# Altium schematic sheet 1-AT_Link_EZ_V1.2.schdoc
size 307 x 228 mm
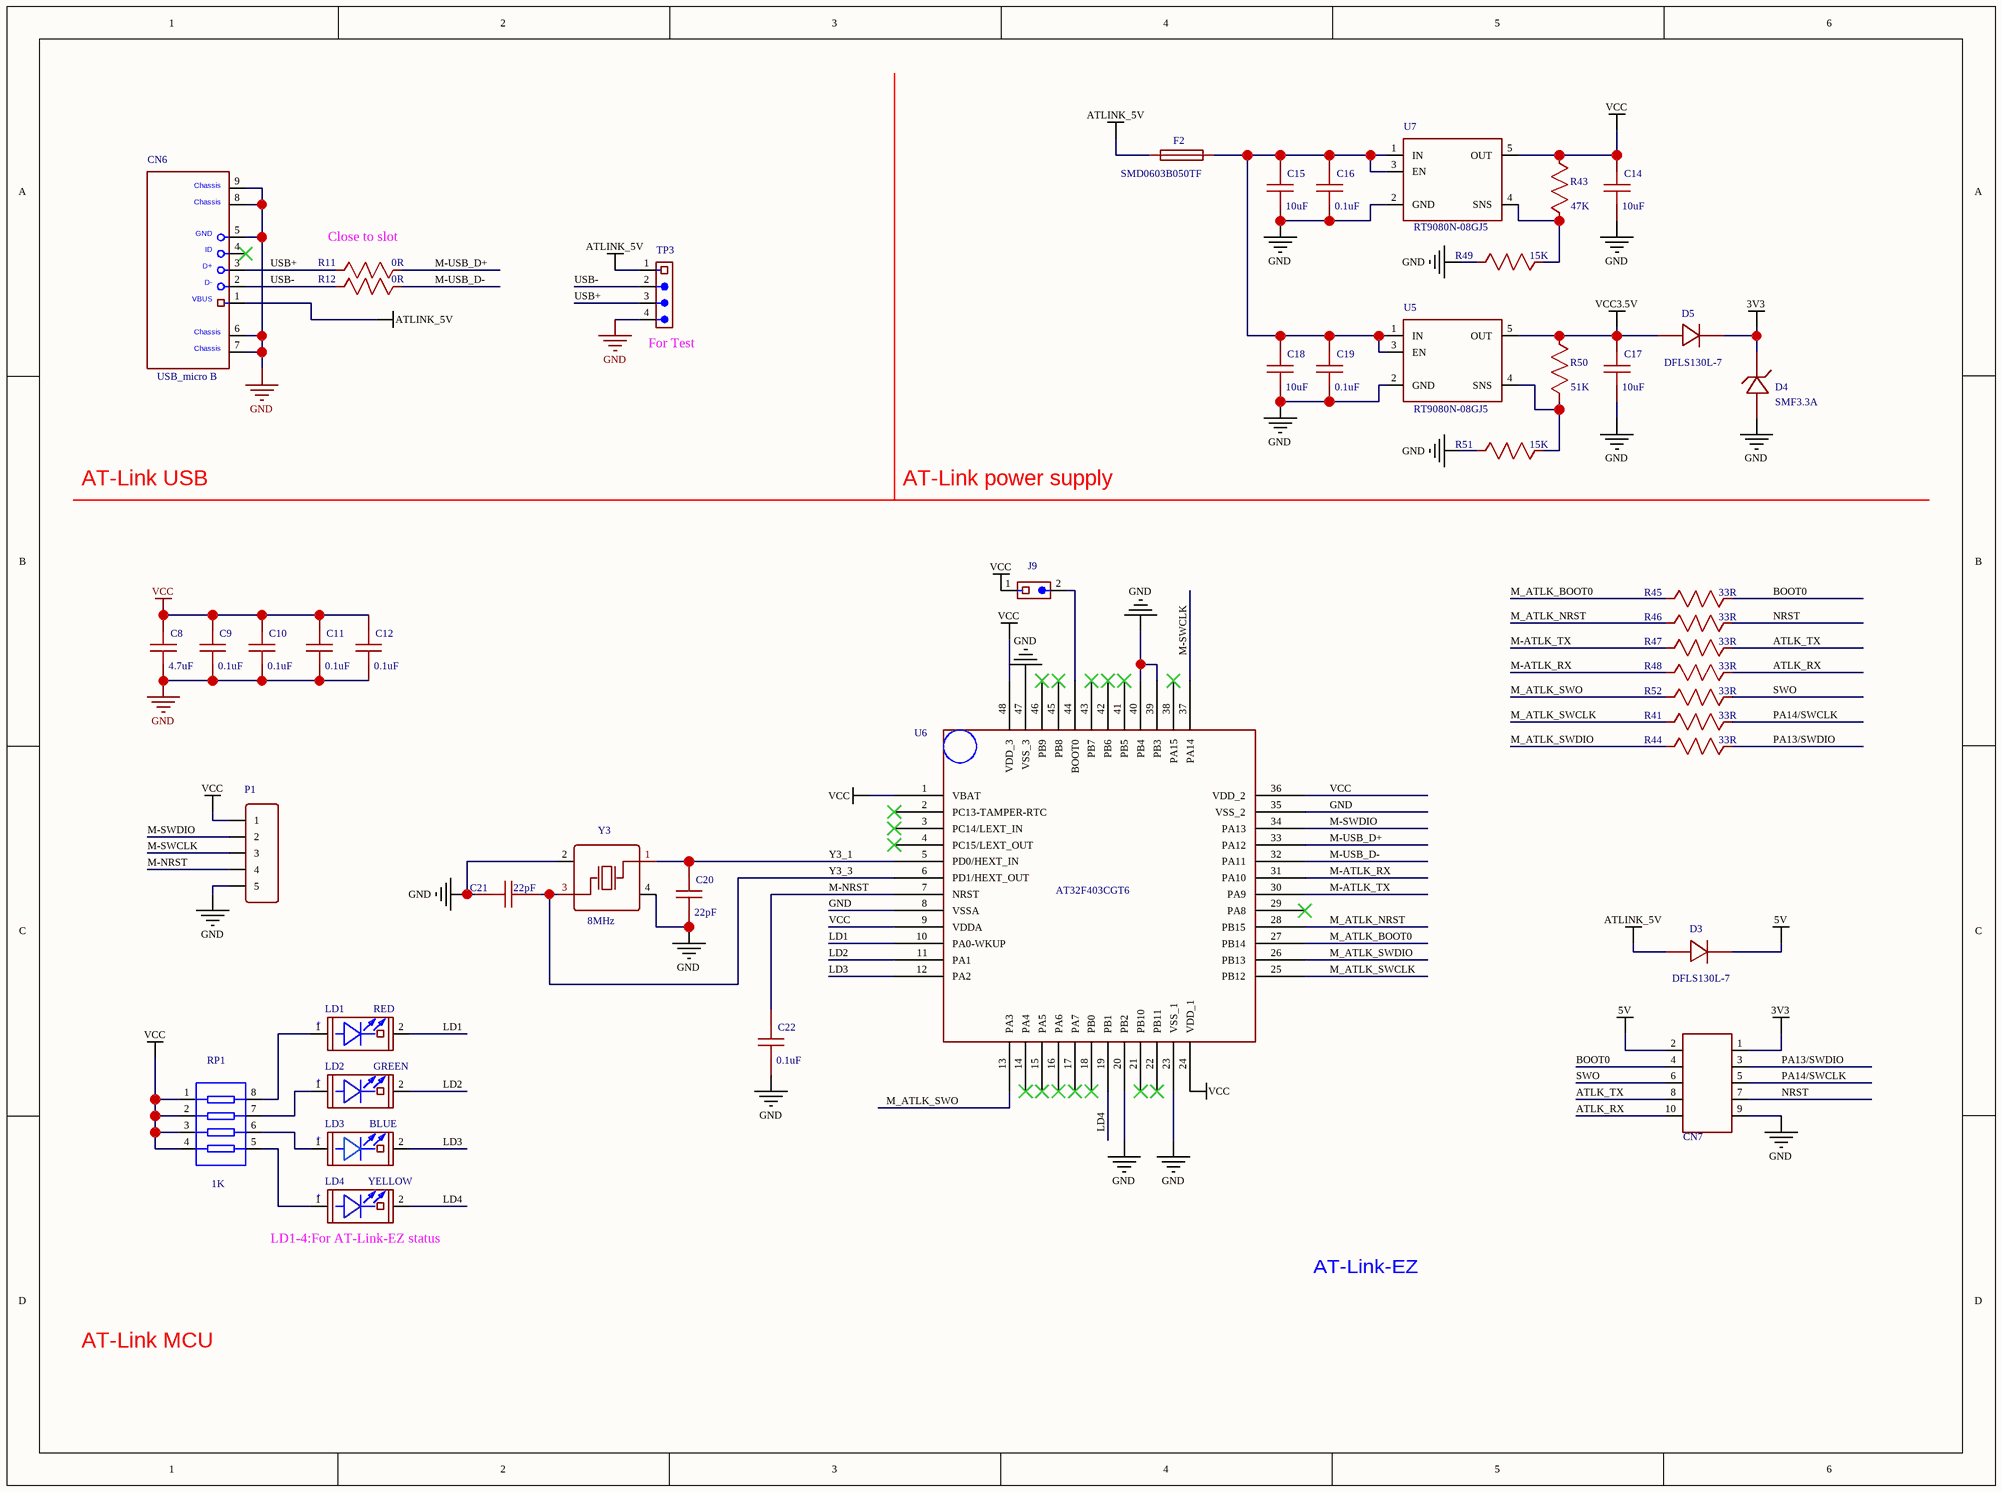
[diagram p0: 1-AT_Link_EZ_V1.2.schdoc]

## Parts
C8  4.7uF  [0603_C-M]
C9  0.1uF  [0603_C-M]
C10  0.1uF  [0603_C-M]
C11  0.1uF  [0603_C-M]
C12  0.1uF  [0603_C-M]
C14  10uF  [0603_C-M]
C15  10uF  [0603_C-M]
C16  0.1uF  [0603_C-M]
C17  10uF  [0603_C-M]
C18  10uF  [0603_C-M]
C19  0.1uF  [0603_C-M]
C20  22pF  [0603_C-M]
C21  22pF  [0603_C-M]
C22  0.1uF  [0603_C-M]
CN6  USB_micro B  [USB_MIC_DIP]
CN7  CON1  [HDR2X5]  (value not drawn)
D3  DFLS130L-7  [POWERDI-123_L2.8-W1.8-LS3.7-RD]
D4  SMF3.3A  [SOD-123_L2.8-W1.8-LS3.7-RD]
D5  DFLS130L-7  [POWERDI-123_L2.8-W1.8-LS3.7-RD]
F2  SMD0603B050TF  [R0603]
J9  1X2P,Male,DIP_2.54  [HDR1X2]  (value not drawn)
LD1  RED  [LED0603]
LD2  GREEN  [LED0603]
LD3  BLUE  [LED0603]
LD4  YELLOW  [LED0603]
P1  HDR-M-2.54_1x5  [HDR-M-2.54_1X5]  (value not drawn)
R11  0R  [0603_R-M]
R12  0R  [0603_R-M]
R41  33R  [0603_R-M]
R43  47K  [0603_R-M]
R44  33R  [0603_R-M]
R45  33R  [0603_R-M]
R46  33R  [0603_R-M]
R47  33R  [0603_R-M]
R48  33R  [0603_R-M]
R49  15K  [0603_R-M]
R50  51K  [0603_R-M]
R51  15K  [0603_R-M]
R52  33R  [0603_R-M]
RP1  1K  [0603*4,8P4R]
TP3  1X4P_2.54F  [HDR1X4 - TOP]  (value not drawn)
U5  RT9080N-08GJ5  [SOT-23-5]
U6  AT32F403CGT6  [LQFP48 - 2]
U7  RT9080N-08GJ5  [SOT-23-5]
Y3  8MHz  [OSC-SMD_4P-L5.0-W3.2-BL]

## Nets
3V3: CN7.1 D4.1 D5.1
5V: CN7.2 D3.1
ATLINK_5V: CN6.1(VBUS) D3.2 F2.1 TP3.1
GND: C8.2 C9.2 C10.2 C11.2 C12.2 C14.2 C15.2 C16.2 C17.2 C18.2 C19.2 C20.2 C21.1 C22.2 CN6.5(GND) CN6.6 CN6.7 CN6.8 CN6.9 CN7.9 D4.2 P1.5 R49.2 R51.2 TP3.4 U5.2(GND) U6.8(VSSA) U6.20(PB2) U6.23(VSS_1) U6.35(VSS_2) U6.39(PB3) U6.40(PB4) U6.47(VSS_3) U7.2(GND) Y3.2(GND) Y3.4(GND)
VCC: C8.1 C9.1 C10.1 C11.1 C12.1 C14.1 J9.1 P1.1 R43.2 RP1.1 RP1.2 RP1.3 RP1.4 U6.1(VBAT) U6.9(VDDA) U6.24(VDD_1) U6.36(VDD_2) U6.48(VDD_3) U7.5(OUT)
VCC3.5V: C17.1 D5.2 R50.2 U5.5(OUT)
ATLK_RX: CN7.10 R48.1
ATLK_TX: CN7.8 R47.1
BOOT0: CN7.4 R45.1
LD1: LD1.2(CATHODE) U6.10(PA0-WKUP)
LD2: LD2.2(CATHODE) U6.11(PA1)
LD3: LD3.2(CATHODE) U6.12(PA2)
LD4: LD4.2(CATHODE) U6.19(PB1)
M-ATLK_RX: R48.2 U6.31(PA10)
M-ATLK_TX: R47.2 U6.30(PA9)
M-NRST: C22.1 P1.4 U6.7(NRST)
M-SWCLK: P1.3 U6.37(PA14)
M-SWDIO: P1.2 U6.34(PA13)
M-USB_D+: R11.2 U6.33(PA12)
M-USB_D-: R12.2 U6.32(PA11)
M_ATLK_BOOT0: R45.2 U6.27(PB14)
M_ATLK_NRST: R46.2 U6.28(PB15)
M_ATLK_SWCLK: R41.2 U6.25(PB12)
M_ATLK_SWDIO: R44.2 U6.26(PB13)
M_ATLK_SWO: R52.2 U6.13(PA3)
NRST: CN7.7 R46.1
PA13/SWDIO: CN7.3 R44.1
PA14/SWCLK: CN7.5 R41.1
SWO: CN7.6 R52.1
USB+: CN6.3(D+) R11.1 TP3.3
USB-: CN6.2(D-) R12.1 TP3.2
Y3_1: C20.1 U6.5(PD0/HEXT_IN) Y3.1(OSC1)
Y3_3: C21.2 U6.6(PD1/HEXT_OUT) Y3.3(OSC2)
NetC15_1: C15.1 C16.1 C18.1 C19.1 F2.2 U5.1(IN) U5.3(EN) U7.1(IN) U7.3(EN)
NetJ9_2: J9.2 U6.44(BOOT0)
NetLD1_1: LD1.1(ANODE) RP1.8
NetLD2_1: LD2.1(ANODE) RP1.7
NetLD3_1: LD3.1(ANODE) RP1.6
NetLD4_1: LD4.1(ANODE) RP1.5
NetR43_1: R43.1 R49.1 U7.4(SNS)
NetR50_1: R50.1 R51.1 U5.4(SNS)

Not connected (* = marked no-connect by the designer): CN6 4(ID)*; U6 2(PC13-TAMPER-RTC)* 3(PC14/LEXT_IN)* 4(PC15/LEXT_OUT)* 14(PA4)* 15(PA5)* 16(PA6)* 17(PA7)* 18(PB0)* 21(PB10)* 22(PB11)* 29(PA8)* 38(PA15)* 41(PB5)* 42(PB6)* 43(PB7)* 45(PB8)* 46(PB9)*

## Notes on the sheet
- Close to slot
- (near TP3) For Test
- AT-Link USB
- AT-Link power supply
- (near LD4) LD1-4:For AT-Link-EZ status
- AT-Link-EZ
- AT-Link MCU
- (in symbol BLUE) +
- (in symbol GREEN) +
- (in symbol RED) +
- (in symbol USB_micro B) Chassis
- (in symbol YELLOW) +

## Library data of the parts
C8 = 4.7uF: nameAlias: Value(F); Contributor: LCEDA_Lib; spicePre: C; spiceSymbolName: C_0603_US
C9-C12 C16 C19 C22 = 0.1uF: nameAlias: Value(F); Contributor: LCEDA_Lib; spicePre: C; spiceSymbolName: C_0603_US
C14 C15 C17 C18 = 10uF: nameAlias: Value(F); Contributor: LCEDA_Lib; spicePre: C; spiceSymbolName: C_0603_US
C20 C21 = 22pF: nameAlias: Value(F); Contributor: LCEDA_Lib; spicePre: C; spiceSymbolName: C_0603_US
D3 D5 = DFLS130L-7: BOM_Manufacturer: Diodes Incorporated; Contributor: LCSC; BOM_Paste Type: expand; BOM_Supplier: LCSC; BOM_Supplier Part: C110493; BOM_Manufacturer Part: DFLS130L-7; spicePre: D; spiceSymbolName: DFLS130L-7
D4 = SMF3.3A: BOM_Manufacturer: DOWO; Contributor: LCSC; BOM_Paste Type: expand; BOM_Supplier: LCSC; BOM_Supplier Part: C283866; BOM_Manufacturer Part: SMF3.3A; spicePre: D; spiceSymbolName: SMF3.3A
F2 = SMD0603B050TF: BOM_Manufacturer: Brightking Elec (TAIWAN); BOM_Manufacturer Part: SMD0603B035TF; Contributor: LCSC; BOM_Paste Type: expand; BOM_Supplier: LCSC; BOM_Supplier Part: C269154; spicePre: U; spiceSymbolName: SMD0603B035TF
J9 = 1X2P,Male,DIP_2.54: Contributor: twb17; spicePre: J; spiceSymbolName: 1X2P,Male,DIP_2.54
P1 = HDR-M-2.54_1x5: Contributor: LCEDA_Lib; BOM_Supplier Part: C358687; BOM_Supplier: LCSC; spicePre: J; spiceSymbolName: HDR-M-2.54_1x5
R11 R12 = 0R: nameAlias: Value(Ω); Contributor: LCEDA_Lib; spicePre: R; spiceSymbolName: R_0603_US
R41 R44-R48 R52 = 33R: nameAlias: Value(Ω); Contributor: LCEDA_Lib; spicePre: R; spiceSymbolName: R_0603_US
R43 = 47K: nameAlias: Value(Ω); Contributor: LCEDA_Lib; spicePre: R; spiceSymbolName: R_0603_US
R49 R51 = 15K: nameAlias: Value(Ω); Contributor: LCEDA_Lib; spicePre: R; spiceSymbolName: R_0603_US
R50 = 51K: nameAlias: Value(Ω); Contributor: LCEDA_Lib; spicePre: R; spiceSymbolName: R_0603_US
RP1 = 1K: Contributor: twb17; spicePre: R; spiceSymbolName: RES_0603*4
Y3 = 8MHz: BOM_Manufacturer: TAE; BOM_Manufacturer Part: SMD-5032_4P8M20pf20ppm; nameAlias: Frequency; Contributor: LCSC; BOM_Paste Type: recommend; BOM_Supplier: LCSC; BOM_Supplier Part: C133333; spicePre: X; spiceSymbolName: SMD-5032_4P8M20PF20PPM